# EAGLE design Lights Project (EAGLE 9.2.0)
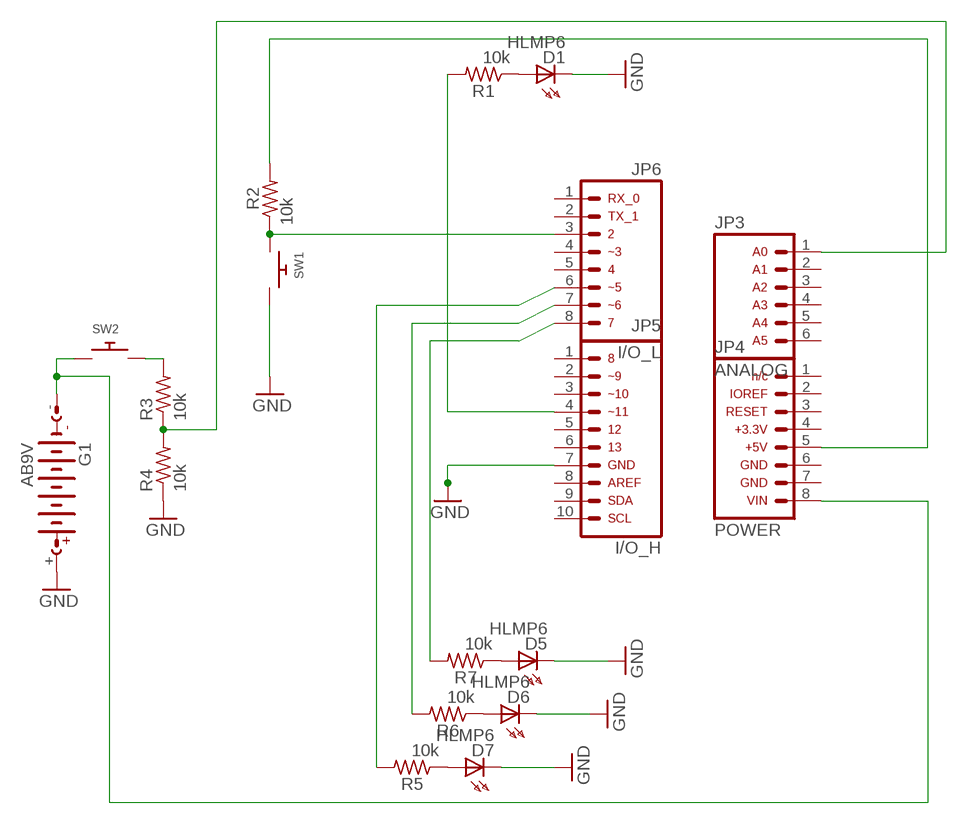
[diagram p0: schematic, sheet 1]

## Parts
D1  HLMP6  [HLMP6]
D5  HLMP6  [HLMP6]
D6  HLMP6  [HLMP6]
D7  HLMP6  [HLMP6]
G1  AB9V  [AB9V]
JP3  ARDUINO_CONN-ANALOGSIP  [CONN-1X06]
JP4  ARDUINO_CONN-POWERSIP  [CONN-1X08]
JP5  ARDUINO_CONN-IO_HSIP  [CONN-1X10]
JP6  ARDUINO_CONN-IO_LSIP  [CONN-1X08]
R1  10k  R-US_R0805  [R0805]
R2  10k  R-US_R0805  [R0805]
R3  10k  R-US_R0805  [R0805]
R4  10k  R-US_R0805  [R0805]
R5  10k  R-US_R0805  [R0805]
R6  10k  R-US_R0805  [R0805]
R7  10k  R-US_R0805  [R0805]
SW1  SWITCH_PUSHBUTTONSOFTTOUCHSMD_SJ  [PUSHBUTTON_SMD_SJ]
SW2  SWITCH_PUSHBUTTONSOFTTOUCHSMD_SJ  [PUSHBUTTON_SMD_SJ]

## Nets
GND: D1.K D5.K D6.K D7.K G1.+ JP5.7 R4.1 SW1.P$2
N$1: G1.- JP4.8 SW2.P$1
N$2: JP5.4 R1.2
N$3: D1.A R1.1
N$4: D5.A R7.1
N$5: JP6.3 R2.1 SW1.P$1
N$6: R3.2 SW2.P$2
N$7: D6.A R6.1
N$8: JP6.6 R5.2
N$9: D7.A R5.1
N$10: JP6.7 R6.2
N$11: JP6.8 R7.2
N$13: JP3.1 R3.1 R4.2
N$14: JP4.5 R2.2
Unconnected: JP3.2 JP3.3 JP3.4 JP3.5 JP3.6 JP4.1 JP4.2 JP4.3 JP4.4 JP4.6 JP4.7 JP5.1 JP5.2 JP5.3 JP5.5 JP5.6 JP5.8 JP5.9 JP5.10 JP6.1 JP6.2 JP6.4 JP6.5

## Library data of the parts
D1 D5-D7 = display-hp:HLMP6: LED 2mm horizontal; MF: AGILENT TECHNOLOGIES; MPN: HLMP-6500; OC_FARNELL: 1652490; OC_NEWARK: 40K0088
G1 = battery:AB9V: 9-V BATTERY CLIP
JP3 = arduino_jw:ARDUINO_CONN-ANALOG: Arduino Analog I/O Header This is the analog I/O header on the Arduino Uno R3. This connector is labeled with the following pin assignments: Analog 0 Analog 1 Analog 2 Analog 3 Analog 4 Analog 5 NOTE: Be sure you install this connector with the correct orientation on your PCB layout. Pin 1 has a square pad to assist with orientation.
JP4 = arduino_jw:ARDUINO_CONN-POWER: Arduino Power Header This is the power header on the Arduino Uno R3. This connector is labeled with the following pin assignments: n/c IO Ref RESET +3.3V +5V GND GND VIN NOTE: Be sure you install this connector with the correct orientation on your PCB layout. Pin 1 has a square pad to assist with orientation.
JP5 = arduino_jw:ARDUINO_CONN-IO_H: Arduino Digital I/O [High Byte] Header This is the Digital I/O [high byte] header on the Arduino Uno R3. This connector is labeled with the following pin assignments: Digital 8 Digital 9 [PWM] Digital 10 [PWM] Digital 11 [PWM] Digital 12 Digital 13 GND AREF SDA SCL NOTE: Be sure you install this connector with the correct orientation on your PCB layout. Pin 1 has a square pad to assist with orientation.
JP6 = arduino_jw:ARDUINO_CONN-IO_L: Arduino Digital I/O [Low Byte] Header This is the Digital I/O [low byte] header on the Arduino Uno R3. This connector is labeled with the following pin assignments: Digital 0, Serial Rx Digital 1, Serial Tx Digital 2 Digital 4 Digital 5 [PWM] Digital 6 [PWM] Digital 7 NOTE: Be sure you install this connector with the correct orientation on your PCB layout. Pin 1 has a square pad to assist with orientation.
R1-R7 = rcl:R-US_: RESISTOR, American symbol; SPICEPREFIX: R
SW1 SW2 = adafruit:SWITCH_PUSHBUTTON: Buttons SOFTTOUCHSMD_SJ - Soft touch temporary push button (Super Junk Akihabara) Compatible with SKPMANE010 [Mouser: 688-SKPMAN] C&K_KSS = Digikey: KSS221GLFS

## Board
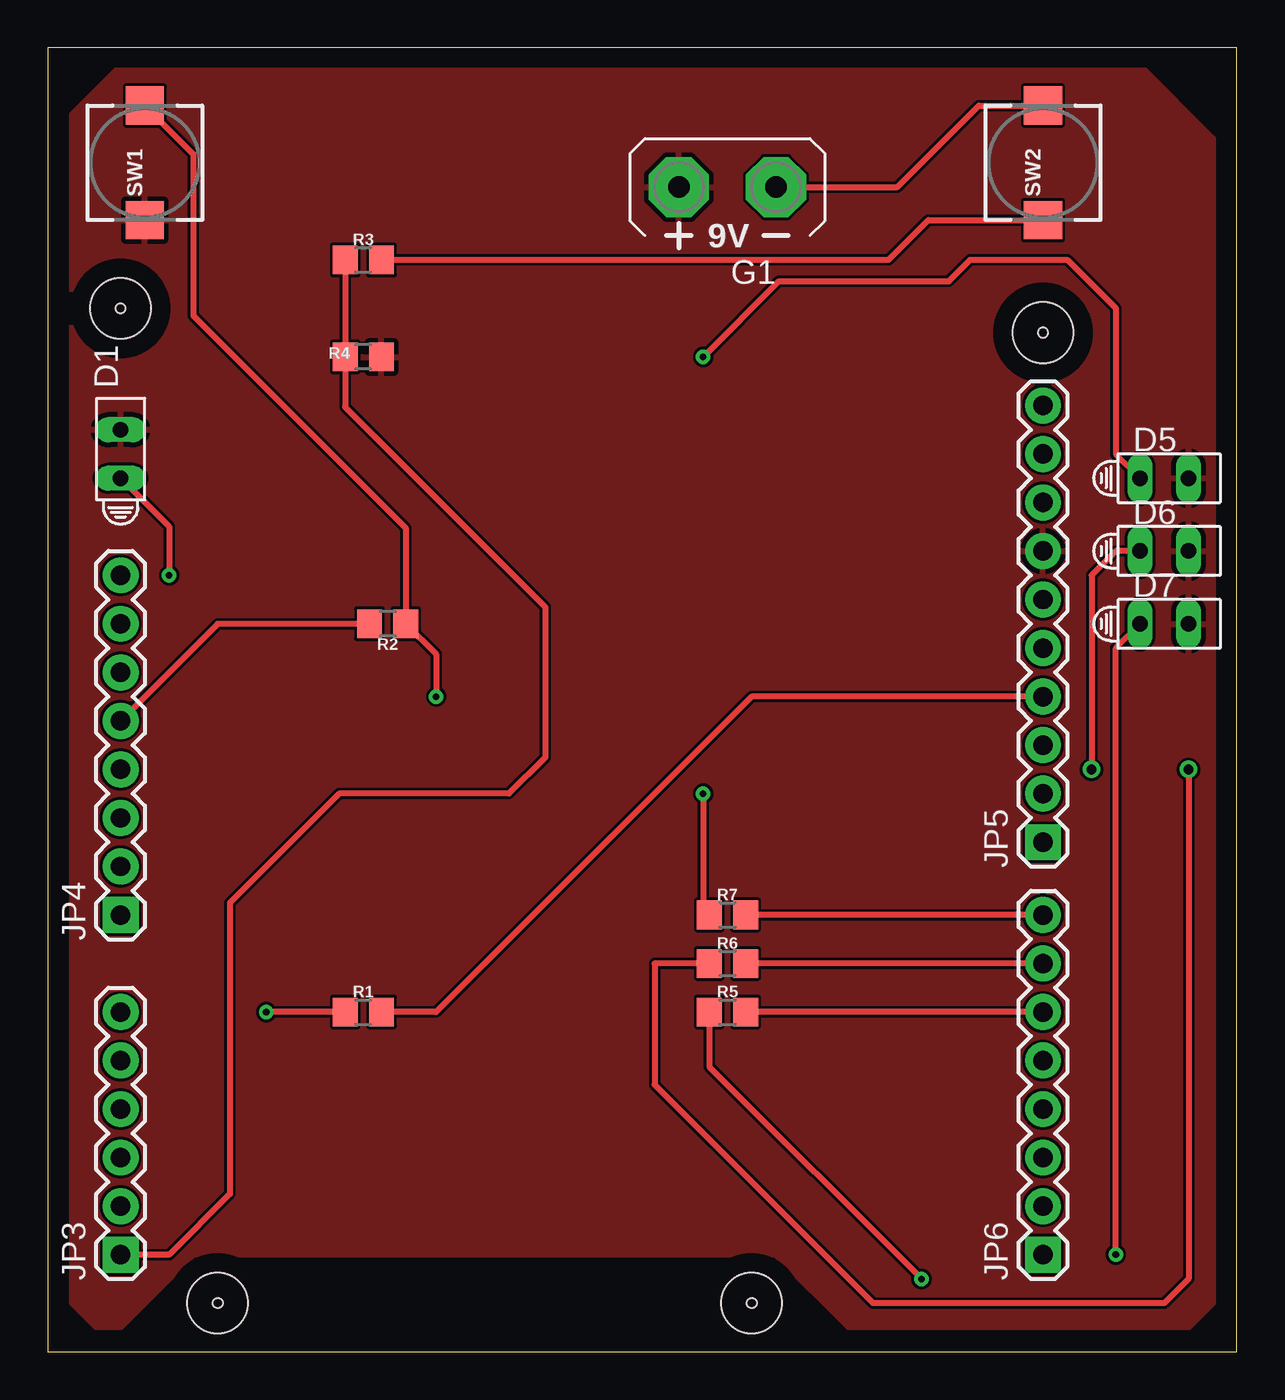
[diagram p1: board, top side]
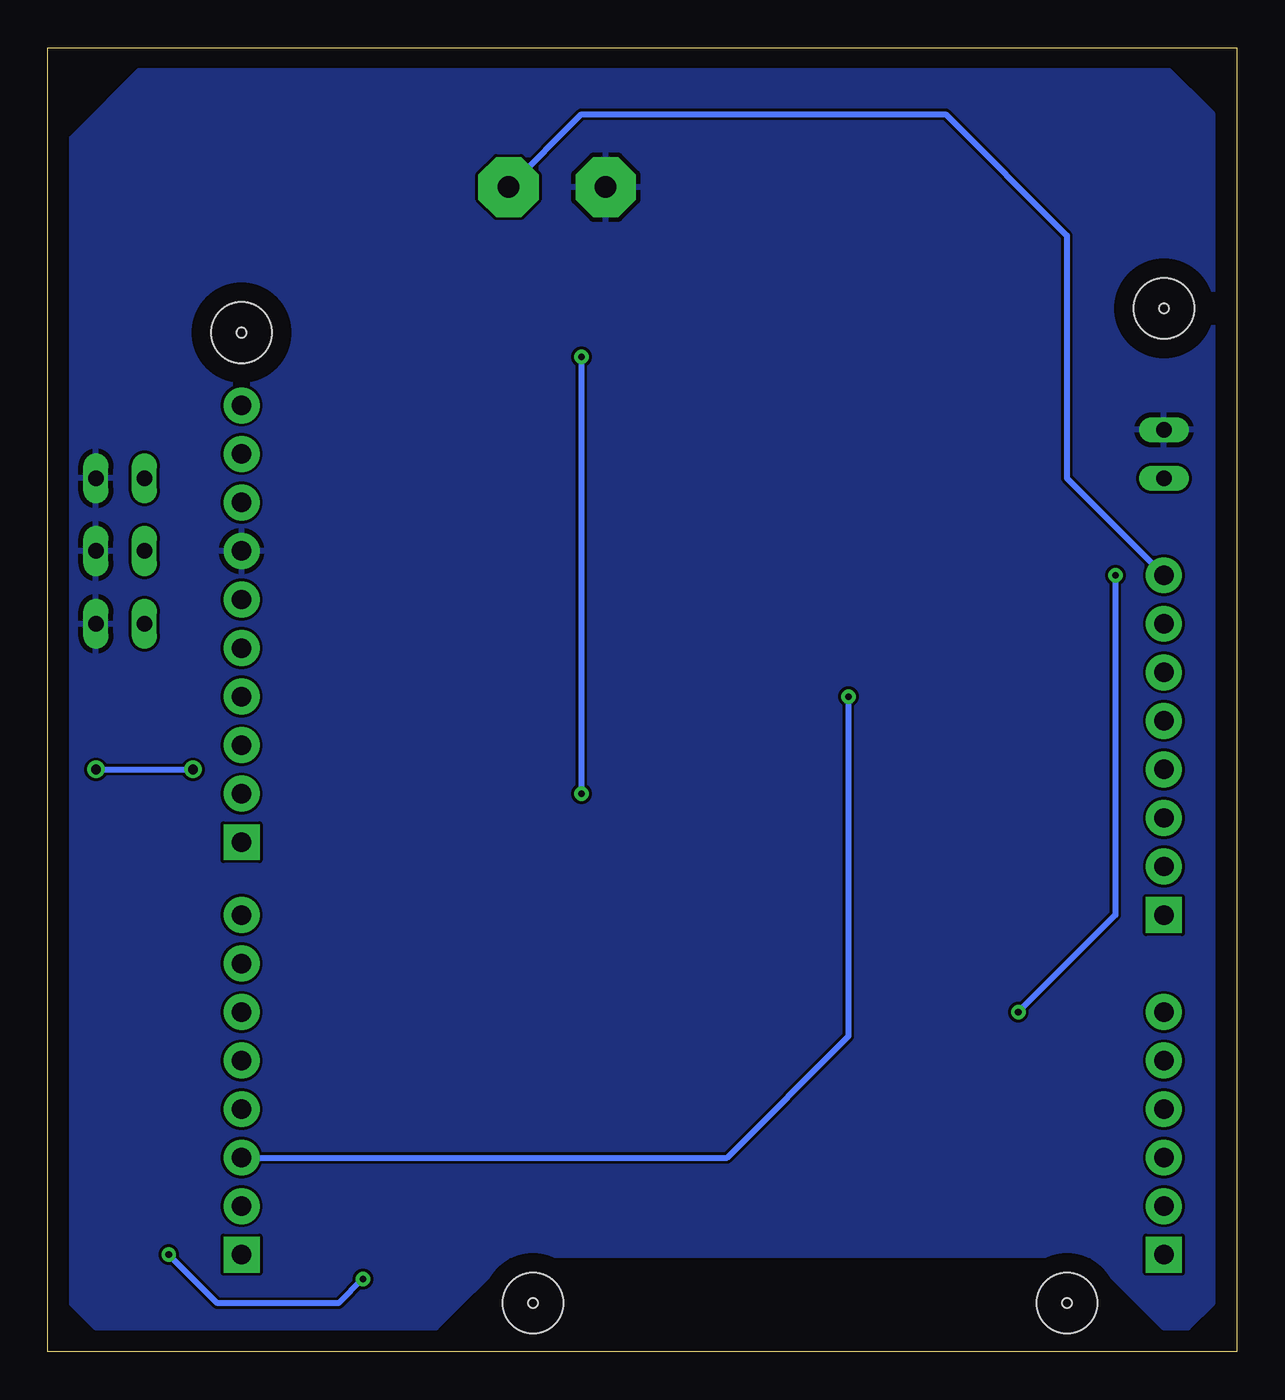
[diagram p2: board, bottom side, seen from below]

Size 62.21 x 68.25 mm. Coordinates in mm from the lower left corner, seen from the top.
Outline: 0,0 62.21,0 62.21,68.25 0,68.25 0,0
Copper layers (1*16): Top 0.035mm / dielectric 1.5mm / Bottom 0.035mm
Design rules "default": minimum track width 6mil, minimum drill 0.35mm, track to track 6mil, track to pad 6mil, pad to pad 6mil, via to via 6mil, smd to smd 6mil, copper to edge 40mil, drill to drill 6mil, minimum pad ring 10mil, minimum via ring 8mil, stop-mask expansion 4mil, vias tented up to drill 0mil, thermal gap 10mil
Holes 0.51 mm at 8.89,2.54 36.83,2.54 3.81,54.61 52.07,53.34
Holes 3.17 mm at 52.07,53.34 8.89,2.54 36.83,2.54 3.81,54.61

### Footprints (pad centres in the part's own frame; a part is rotated, then mirrored left to right if it is on the bottom)
HLMP6 = drill 0.813 long: A -1.27,0; K 1.27,0
AB9V = drill 1.118 pad 3.15 octagon: + 0,2.54; - 0,-2.54
CONN-1X06 = drill 1.016 pad 1.88 square: 1 0,0 | drill 1.016 pad 1.88: 2 2.54,0; 3 5.08,0; 4 7.62,0; 5 10.16,0; 6 12.7,0
CONN-1X08 = drill 1.016 pad 1.88 square: 1 0,0 | drill 1.016 pad 1.88: 2 2.54,0; 3 5.08,0; 4 7.62,0; 5 10.16,0; 6 12.7,0; 7 15.24,0; 8 17.78,0
CONN-1X10 = drill 1.016 pad 1.88 square: 1 0,0 | drill 1.016 pad 1.88: 2 2.54,0; 3 5.08,0; 4 7.62,0; 5 10.16,0; 6 12.7,0; 7 15.24,0; 8 17.78,0; 9 20.32,0; 10 22.86,0
R0805 = smd 1.3 x 1.5: 1 -0.95,0; 2 0.95,0
PUSHBUTTON_SMD_SJ = smd 2 x 2: P$1 3,0; P$2 -3,0

### Placement (x,y rotation side)
D1  3.81,46.99 90 top
D5  58.42,45.72 0 top
D6  58.42,41.91 0 top
D7  58.42,38.1 0 top
G1  35.56,60.96 90 top
JP3  3.81,5.08 90 top
JP4  3.81,22.86 90 top
JP5  52.07,26.67 90 top
JP6  52.07,5.08 90 top
R1  16.51,17.78 0 top
R2  17.78,38.1 180 top
R3  16.51,57.15 0 top
R4  16.51,52.07 180 top
R5  35.56,17.78 0 top
R6  35.56,20.32 0 top
R7  35.56,22.86 0 top
SW1  5.08,62.23 90 top
SW2  52.07,62.23 90 top

### Tracks (layer width: path | path; a pad name or v marks a point on that pad's centre or on a via)
GND
  pour Top: 1.27,64.77 3.81,67.31 57.15,67.31 60.96,63.5 60.96,2.54 59.69,1.27 41.91,1.27 38.1,5.08 33.02,5.08 7.62,5.08 3.81,1.27 2.54,1.27 1.27,2.54
  pour Bottom: 1.27,64.77 3.81,67.31 57.15,67.31 60.96,63.5 60.96,2.54 59.69,1.27 41.91,1.27 38.1,5.08 36.83,5.08 7.62,5.08 3.81,1.27 2.54,1.27 1.27,2.54
N$1
  Top 0.305: G1.- 44.45,60.96 48.72,65.23 SW2.P$1
  Bottom 0.305: JP4.8 8.89,45.72 8.89,58.42 15.24,64.77 34.29,64.77 G1.-
N$2
  Top 0.305: R1.2 20.32,17.78 36.83,34.29 JP5.4
N$3  (via drill 0.35)
  Top 0.305: 15.24,17.46 R1.1 v11.43,17.78 | D1.A 6.35,43.18 v6.35,40.64
  Bottom 0.305: v6.35,40.64 6.35,22.86 v11.43,17.78
N$4  (via drill 0.35)
  Top 0.305: D5.A 55.88,46.99 55.88,54.61 53.34,57.15 48.26,57.15 47.14,56.03 38.25,56.03 v34.29,52.07 | R7.1 34.29,23.18 v34.29,29.21
  Bottom 0.305: v34.29,52.07 v34.29,29.21
N$5  (via drill 0.35)
  Top 0.305: v20.32,34.29 20.32,36.51 R2.1 18.73,43.11 7.62,54.22 7.62,62.69 SW1.P$1
  Bottom 0.305: JP6.3 26.67,10.16 20.32,16.51 v20.32,34.29
N$6
  Top 0.305: R3.2 43.99,57.15 46.07,59.23 SW2.P$2
N$7  (via drill 0.51)
  Top 0.305: R6.1 31.75,20.32 31.75,13.97 43.18,2.54 58.42,2.54 59.69,3.81 v59.69,30.48 | v54.61,30.48 54.61,40.64 55.88,41.91 D6.A
  Bottom 0.305: v59.69,30.48 v54.61,30.48
N$8
  Top 0.305: JP6.6 R5.2
N$9  (via drill 0.35)
  Top 0.305: R5.1 34.61,14.92 v45.72,3.81 | D7.A 55.88,36.83 v55.88,5.08
  Bottom 0.305: v45.72,3.81 46.99,2.54 53.34,2.54 v55.88,5.08
N$10
  Top 0.305: JP6.7 R6.2
N$11
  Top 0.305: JP6.8 R7.2
N$13
  Top 0.305: R3.1 R4.2 15.56,49.45 26.04,38.98 26.04,31.11 24.13,29.21 15.24,29.21 9.53,23.5 9.53,8.26 6.35,5.08 JP3.1
N$14
  Top 0.305: JP4.5 8.89,38.1 R2.2